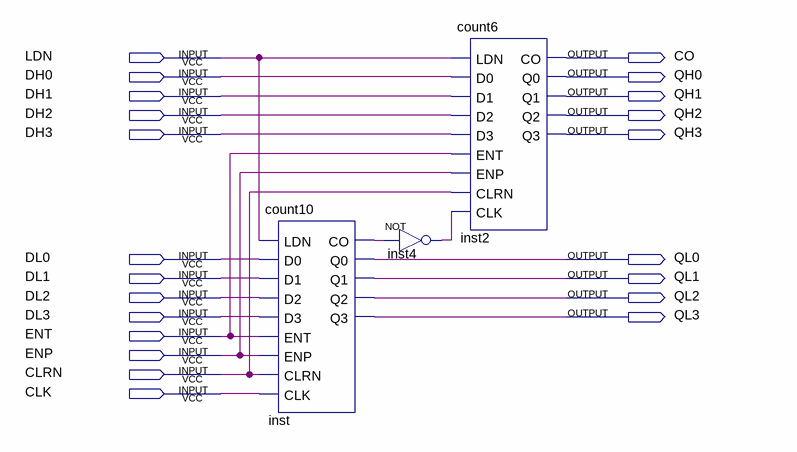
[diagram p0: schematic sheet]
// Quartus schematic count60.bdf as structural Verilog: 3 symbols, 22 pins
module count60 (
  input  LDN,
  input  DH0,
  input  DH1,
  input  DH2,
  input  DH3,
  input  DL0,
  input  DL1,
  input  DL2,
  input  DL3,
  input  ENT,
  input  ENP,
  input  CLRN,
  input  CLK,
  output CO,
  output QH0,
  output QH1,
  output QH2,
  output QH3,
  output QL0,
  output QL1,
  output QL2,
  output QL3
);

  wire inst4_out, inst_co;

  count10 inst (
    .LDN(LDN), .D0(DL0), .D1(DL1), .D2(DL2), .D3(DL3), .ENT(ENT), .ENP(ENP), .CLRN(CLRN), .CLK(CLK),
    .CO(inst_co), .Q0(QL0), .Q1(QL1), .Q2(QL2), .Q3(QL3));
  not inst4 (inst4_out, inst_co);
  count6 inst2 (
    .LDN(LDN), .D0(DH0), .D1(DH1), .D2(DH2), .D3(DH3), .ENT(ENT), .ENP(ENP), .CLRN(CLRN), .CLK(inst4_out),
    .CO(CO), .Q0(QH0), .Q1(QH1), .Q2(QH2), .Q3(QH3));
endmodule
